# Altium schematic sheet 13-UWB-Antenna.SchDoc
size A; SheetNumber: 13; SheetTotal: 16
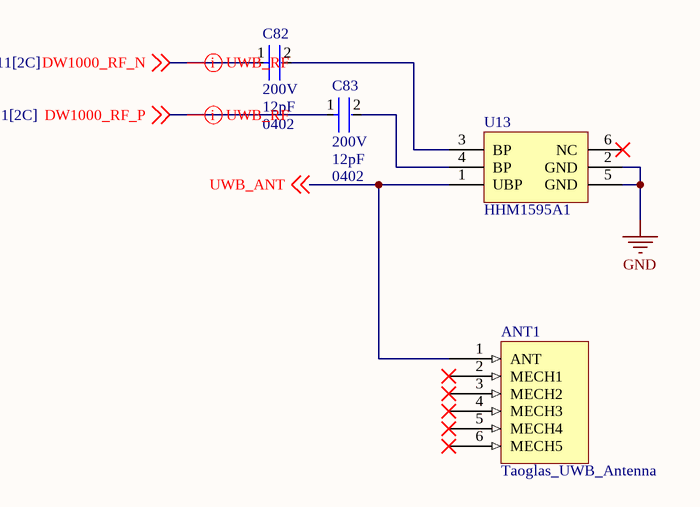
[diagram p0: 13-UWB-Antenna.SchDoc]

## Parts
ANT1  Taoglas_UWB_Antenna  [UWC.20 Antenna]
C82  Voltage Rating (DC): 200V  Capacitance: 12pF  Case/Package: 0402  [FP-GQM155-0_05-MFG]  (hidden comment: GQM1555C2D120FB01D)
C83  Voltage Rating (DC): 200V  Capacitance: 12pF  Case/Package: 0402  [FP-GQM155-0_05-MFG]  (hidden comment: GQM1555C2D120FB01D)
U13  HHM1595A1  [TDK-HHM1595A1_V]

## Nets
GND: U13.2(GND) U13.5(GND)
DW1000_RF_N: C82.1 ; off-sheet DW1000_RF_N
DW1000_RF_P: C83.1 ; off-sheet DW1000_RF_P
UWB_ANT: ANT1.1(ANT) U13.1(UBP) ; off-sheet UWB_ANT
NetC82_2: C82.2 U13.3(BP)
NetC83_2: C83.2 U13.4(BP)

Not connected (* = marked no-connect by the designer): ANT1 2(MECH1)* 3(MECH2)* 4(MECH3)* 5(MECH4)* 6(MECH5)*; U13 6(NC)*

## Layout directives
differential pair: DW1000_RF_N, DW1000_RF_P

## Library data of the parts
C82 C83 = CMP-06035-014182-1: Ceramic Capacitor 12pF  ±1% 200VDC C0G 0402 Paper T/R; Tolerance: 1%; Width: 0.02inch; Dielectric: C0G; Voltage Rating: 200V; Packaging: Tape and Reel; Thickness: 0.022inch; Length: 0.039inch; Mount: Surface Mount; Min Operating Temperature: -55°C; Max Operating Temperature: 125°C
U13 = CMP-2000-07459-1: Multilayer Balun, 3000 to 8000 MHz, -40 to 85 degC, 6-Pin SMD, RoHS, Tape and Reel; Manufacturer: TDK; Case\/Package: 0805; Impedance: 100Ohm; Insertion Loss: 1.5dB; Radiation Hardening: No; Number of Pins: 6; Manufacturer URL: http://www.tdk.com/; Min Operating Temperature: -40degC; Mounting Technology: SurfaceMount; RoHSCompliant: true; Package Description: 6-Pin Surface Mount Device, Body 2 x 1.25 mm, Pitch 0.65 mm; Datasheet URL: https://product.tdk.com/info/en/documents/data_sheet/rf_balun_hhm1595a1_en.pdf; Package Quantity: 1; Max Operating Temperature: 85degC; Packaging: TapeandReel; Package Reference: HHM1595A1; Termination: SMD/SMT; Datasheet Version: 04/2015; Case Code (Imperial): 0805; Case Code (Metric): 2012